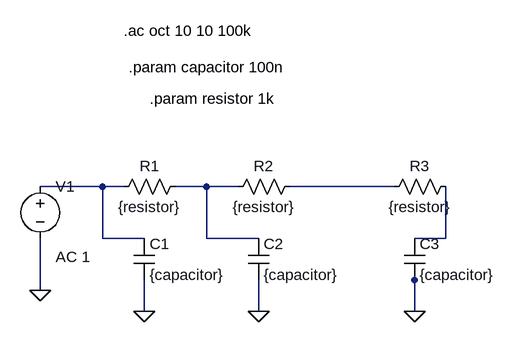
[diagram p0: schematic ep3 first.asc]
ep3 first.asc, the LTspice schematic file:
Version 4
SHEET 1 880 680
WIRE 48 144 -48 144
WIRE 80 144 48 144
WIRE 208 144 160 144
WIRE 256 144 208 144
WIRE 496 144 336 144
WIRE 48 224 48 144
WIRE 112 224 48 224
WIRE 208 224 208 144
WIRE 288 224 208 224
WIRE 576 224 576 144
WIRE 576 224 528 224
WIRE 528 288 528 272
WIRE -48 304 -48 224
WIRE 112 336 112 288
WIRE 288 336 288 288
WIRE 528 336 528 288
FLAG -48 304 0
FLAG 112 336 0
FLAG 288 336 0
FLAG 528 336 0
SYMBOL voltage -48 128 R0
WINDOW 123 24 124 Left 2
WINDOW 39 0 0 Left 0
SYMATTR InstName V1
SYMATTR Value ""
SYMATTR Value2 AC 1
SYMBOL res 176 128 R90
WINDOW 0 0 56 VBottom 2
WINDOW 3 32 56 VTop 2
SYMATTR InstName R1
SYMATTR Value {resistor}
SYMBOL res 352 128 R90
WINDOW 0 0 56 VBottom 2
WINDOW 3 32 56 VTop 2
SYMATTR InstName R2
SYMATTR Value {resistor}
SYMBOL res 592 128 R90
WINDOW 0 0 56 VBottom 2
WINDOW 3 32 56 VTop 2
SYMATTR InstName R3
SYMATTR Value {resistor}
SYMBOL cap 96 224 R0
SYMATTR InstName C1
SYMATTR Value {capacitor}
SYMBOL cap 272 224 R0
SYMATTR InstName C2
SYMATTR Value {capacitor}
SYMBOL cap 512 224 R0
SYMATTR InstName C3
SYMATTR Value {capacitor}
TEXT 120 8 Left 2 !.param resistor 1k
TEXT 88 -40 Left 2 !.param capacitor 100n
TEXT 80 -96 Left 2 !.ac oct 10 10 100k

The netlist it stands for:
* ep3 first.asc
V1 N001 0 AC 1
R1 N002 N001 {resistor}
R2 N003 N002 {resistor}
R3 N004 N003 {resistor}
C1 N001 0 {capacitor}
C2 N002 0 {capacitor}
C3 N004 0 {capacitor}
.param resistor 1k
.param capacitor 100n
.ac oct 10 10 100k
.backanno
.end